# EasyEDA Pro project ProPrj_OASman SMD test board 2_2025-03-03.epro

# Schematic Schematic1_3
Board Name: SMD test 2; Create Date: 2025-02-23; Page Name: P1; Project Name: OASman SMD test board 2; Schematic Name: Schematic1_3; Update Date: 2025-02-23; Company: EasyEDA.com; Page Size: A4; Version: V1.0
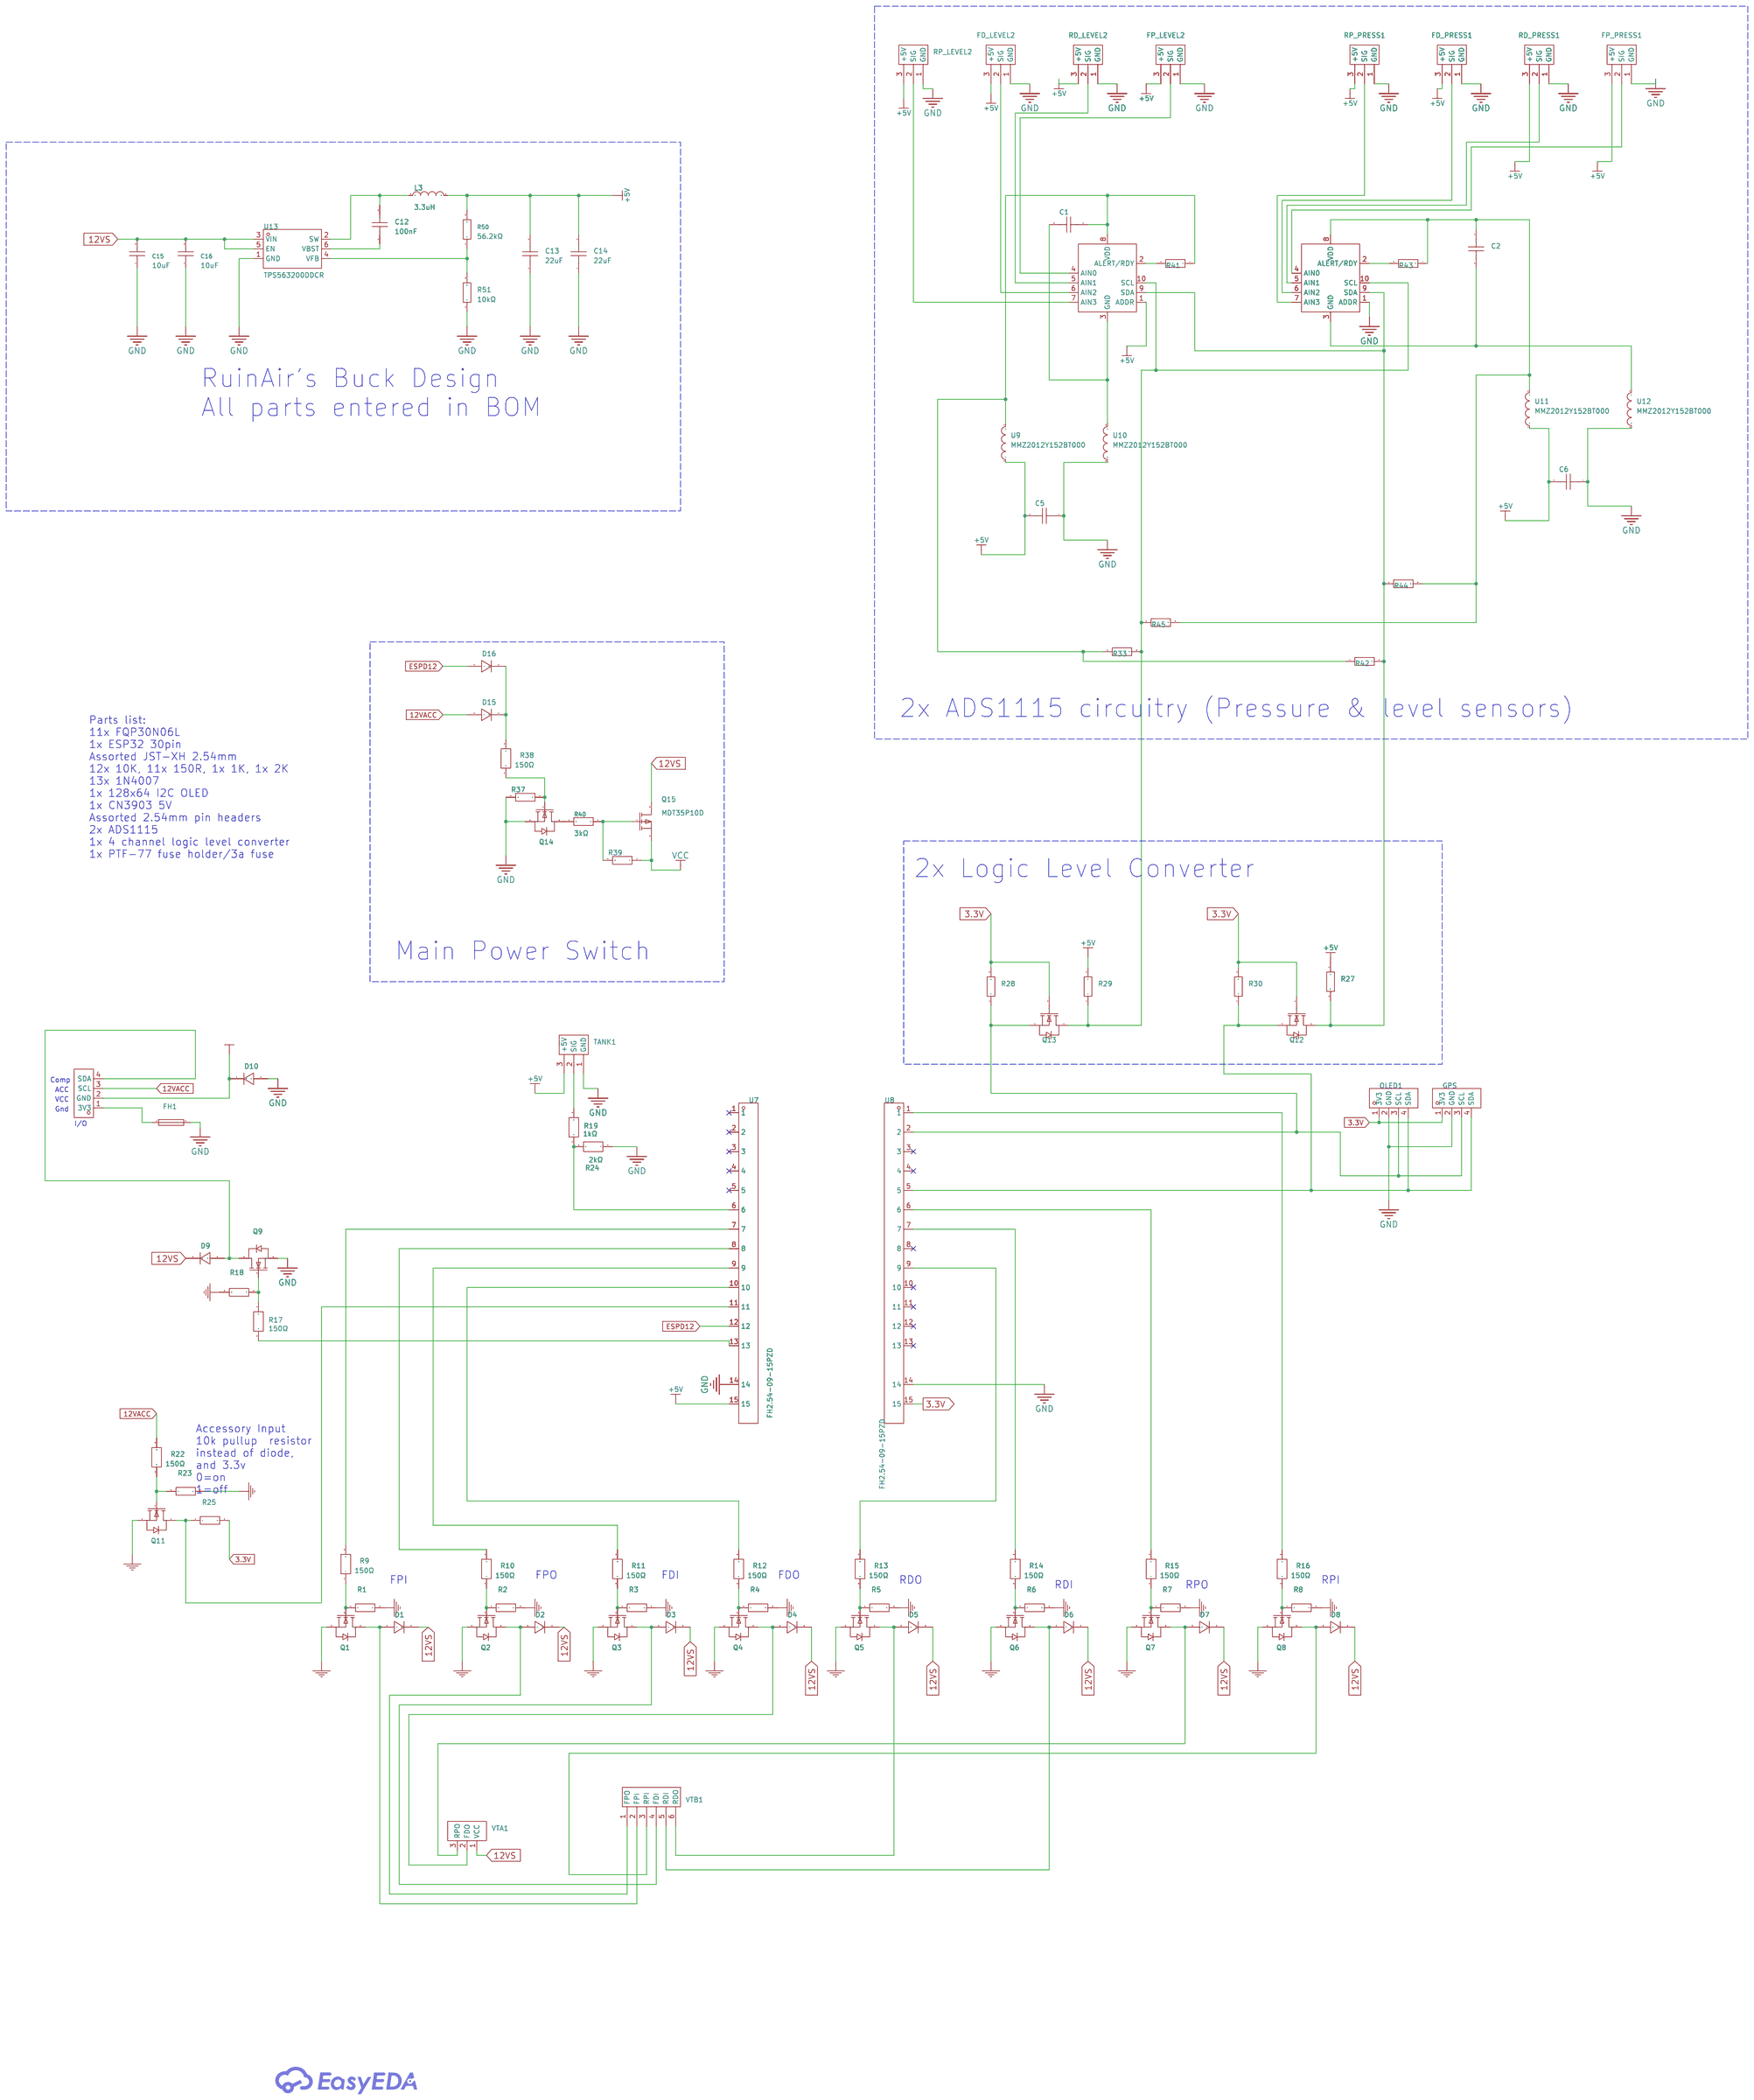
[diagram p0: schematic sheet]

## Parts
C1  1uF  [C0603]
C2  1uF  [C0603]
C5  1uF  [C0603]
C6  1uF  [C0603]
C12  100nF  [C0402]
C13  22uF  [C0805]
C14  22uF  [C0805]
C15  10uF  [C1206]
C16  10uF  [C1206]
CN1  XH-4A绿色  [CONN-TH_XH-4A-1]
D1  SM4007PL  [SOD-123F_L2.8-W1.8-LS3.7-RD]
D2  SM4007PL  [SOD-123F_L2.8-W1.8-LS3.7-RD]
D3  SM4007PL  [SOD-123F_L2.8-W1.8-LS3.7-RD]
D4  SM4007PL  [SOD-123F_L2.8-W1.8-LS3.7-RD]
D5  SM4007PL  [SOD-123F_L2.8-W1.8-LS3.7-RD]
D6  SM4007PL  [SOD-123F_L2.8-W1.8-LS3.7-RD]
D7  SM4007PL  [SOD-123F_L2.8-W1.8-LS3.7-RD]
D8  SM4007PL  [SOD-123F_L2.8-W1.8-LS3.7-RD]
D9  SM4007PL  [SOD-123F_L2.8-W1.8-LS3.7-RD]
D10  SM4007PL  [SOD-123F_L2.8-W1.8-LS3.7-RD]
D15  SM4007PL  [SOD-123F_L2.8-W1.8-LS3.7-RD]
D16  SM4007PL  [SOD-123F_L2.8-W1.8-LS3.7-RD]
FD_LEVEL2  XH-3A  [CONN-TH_XH-3A]
FD_PRESS1  XH-3A  [CONN-TH_XH-3A]
FH1  PTF-77  [FUSE-TH_L24.4-W9.4-P22.60]
FP_LEVEL2  XH-3A  [CONN-TH_XH-3A]
FP_PRESS1  XH-3A  [CONN-TH_XH-3A]
GPS  XH-4A绿色  [CONN-TH_XH-4A-1]
L3  3.3uH  [IND-SMD_L4.5-W4.1_SL0420]
OLED1  XH-4A绿色  [CONN-TH_XH-4A-1]
Q1  MDT30N06L  [TO-252-2_L6.6-W5.6-P4.60-LS9.7-BR]
Q2  MDT30N06L  [TO-252-2_L6.6-W5.6-P4.60-LS9.7-BR]
Q3  MDT30N06L  [TO-252-2_L6.6-W5.6-P4.60-LS9.7-BR]
Q4  MDT30N06L  [TO-252-2_L6.6-W5.6-P4.60-LS9.7-BR]
Q5  MDT30N06L  [TO-252-2_L6.6-W5.6-P4.60-LS9.7-BR]
Q6  MDT30N06L  [TO-252-2_L6.6-W5.6-P4.60-LS9.7-BR]
Q7  MDT30N06L  [TO-252-2_L6.6-W5.6-P4.60-LS9.7-BR]
Q8  MDT30N06L  [TO-252-2_L6.6-W5.6-P4.60-LS9.7-BR]
Q9  MDT30N06L  [TO-252-2_L6.6-W5.6-P4.60-LS9.7-BR]
Q11  MDT30N06L  [TO-252-2_L6.6-W5.6-P4.60-LS9.7-BR]
Q12  BSS138  [SOT-23-3_L2.9-W1.6-P1.90-LS2.8-BR]
Q13  BSS138  [SOT-23-3_L2.9-W1.6-P1.90-LS2.8-BR]
Q14  MDT30N06L  [TO-252-2_L6.6-W5.6-P4.60-LS9.7-BR]
Q15  MDT35P10D  [TO-252-2_L6.6-W6.1-P4.57-LS9.9-BR-CW]
R1  10kΩ  [R1206]
R2  10kΩ  [R1206]
R3  10kΩ  [R1206]
R4  10kΩ  [R1206]
R5  10kΩ  [R1206]
R6  10kΩ  [R1206]
R7  10kΩ  [R1206]
R8  10kΩ  [R1206]
R9  150Ω  [R1206]
R10  150Ω  [R1206]
R11  150Ω  [R1206]
R12  150Ω  [R1206]
R13  150Ω  [R1206]
R14  150Ω  [R1206]
R15  150Ω  [R1206]
R16  150Ω  [R1206]
R17  150Ω  [R1206]
R18  10kΩ  [R1206]
R19  1kΩ  [R1206]
R22  150Ω  [R1206]
R23  10kΩ  [R1206]
R24  2kΩ  [R1206]
R25  10kΩ  [R1206]
R27  10kΩ  [R1206]
R28  10kΩ  [R1206]
R29  10kΩ  [R1206]
R30  10kΩ  [R1206]
R33  1MΩ  [R1206]
R37  10kΩ  [R1206]
R38  150Ω  [R1206]
R39  10kΩ  [R1206]
R40  3kΩ  [R1206]
R41  1MΩ  [R1206]
R42  1MΩ  [R1206]
R43  1MΩ  [R1206]
R44  1MΩ  [R1206]
R45  1MΩ  [R1206]
R50  56.2kΩ  [R0402]
R51  10kΩ  [R0402]
RD_LEVEL2  XH-3A  [CONN-TH_XH-3A]
RD_PRESS1  XH-3A  [CONN-TH_XH-3A]
RP_LEVEL2  XH-3A  [CONN-TH_XH-3A]
RP_PRESS1  XH-3A  [CONN-TH_XH-3A]
TANK1  XH-3A  [CONN-TH_XH-3A]
U4  ADS1115IDGSR  [MSOP-10_L3.0-W3.0-P0.50-LS5.0-BL]
U5  ADS1115IDGSR  [MSOP-10_L3.0-W3.0-P0.50-LS5.0-BL]
U7  FH2.54-09-15PZD  [HDR-TH_15P-P2.54-V-F-1]
U8  FH2.54-09-15PZD  [HDR-TH_15P-P2.54-V-F-1]
U9  MMZ2012Y152BT000  [L0805]
U10  MMZ2012Y152BT000  [L0805]
U11  MMZ2012Y152BT000  [L0805]
U12  MMZ2012Y152BT000  [L0805]
U13  TPS563200DDCR  [SOT-23-6_L2.9-W1.6-P0.95-LS2.8-BR]
VTA1  XH-3A  [CONN-TH_XH-3A]
VTB1  XH-6A  [CONN-TH_6P-P2.50_XH-6A]

## Library data of the parts
C1 C2 C5 C6 = GRM188R61H105KAALD: Capacitance: Tolerance:±10% Tolerance:±10% Voltage Rated: Temperature Coefficient:; LCSC Part Name: 1uF ±10% 50V; Supplier Part: C77386; Manufacturer: muRata(村田); Supplier Footprint: 0603; JLCPCB Part Class: Extended Part; Datasheet: https://atta.szlcsc.com/upload/public/pdf/source/20170116/1484561238855.pdf; Supplier: LCSC; Tolerance: ±10%
C12 = CL05B104KB54PNC: Capacitance: Tolerance:±10% Tolerance:±10% Voltage Rated: Temperature Coefficient:; LCSC Part Name: 100nF ±10% 50V; Supplier Part: C307331; Manufacturer: SAMSUNG(三星); Supplier Footprint: 0402; JLCPCB Part Class: Basic Part; Datasheet: https://atta.szlcsc.com/upload/public/pdf/source/20160218/1457707763339.pdf; Supplier: LCSC; Tolerance: ±10%
C13 C14 = CL21A226MAQNNNE: Capacitance: Tolerance:±20% Tolerance:±20% Voltage Rated: Temperature Coefficient:; LCSC Part Name: 22uF ±20% 25V; Supplier Part: C45783; Manufacturer: SAMSUNG(三星); Supplier Footprint: 0805; JLCPCB Part Class: Basic Part; Datasheet: https://atta.szlcsc.com/upload/public/pdf/source/20160218/1457707763339.pdf; Supplier: LCSC; Tolerance: ±20%
C15 C16 = CL31A106KBHNNNE: Capacitance: Tolerance:±10% Tolerance:±10% Voltage Rated: Temperature Coefficient:; LCSC Part Name: 10uF ±10% 50V; Supplier Part: C13585; Manufacturer: SAMSUNG(三星); Supplier Footprint: 1206; JLCPCB Part Class: Basic Part; Datasheet: https://atta.szlcsc.com/upload/public/pdf/source/20160218/1457707763339.pdf; Supplier: LCSC; Tolerance: ±10%
CN1 GPS OLED1 = XH-4A绿色: Pins Structure:1x4P Pitch:- Mounting Style:- Reference Series:XH Number of Pins:4P Number of Rows:1 Number of PINs Per Row:4 Row Spacing:- Contact Material:-; LCSC Part Name: 1x4P 系列:XH; Supplier Part: C192885; Manufacturer: BOOMELE(博穆精密); Supplier Footprint: 插件,P=2.5mm; JLCPCB Part Class: Extended Part; Supplier: LCSC; Pins Structure: 1x4P; Reference Series: XH; Number of Pins: 4P; Number of Rows: 1; Number of PINs Per Row: 4
D1-D10 D15 D16 = SM4007PL_C64898: Diode Configuration: Forward Voltage (Vf@If):1.1V@1A Reverse Voltage (Vr): Rectified Current: Reverse Leakage Current:10uA@1kV; LCSC Part Name: 电压:1kV 电流:1A; Supplier Part: C64898; Manufacturer: MDD(辰达半导体); Supplier Footprint: SOD-123FL; JLCPCB Part Class: Basic Part; Datasheet: https://atta.szlcsc.com/upload/public/pdf/source/20230823/16A8FDE162764C9B685A3717F2DA3690.pdf; Supplier: LCSC; Forward Voltage (Vf@If): 1.1V@1A; Reverse Leakage Current: 10uA@1kV
FD_LEVEL2 FD_PRESS1 FP_LEVEL2 FP_PRESS1 RD_LEVEL2 RD_PRESS1 RP_LEVEL2 RP_PRESS1 TANK1 VTA1 = XH-3A_C2316: Pins Structure:1x3P Pitch:2.5mm Mounting Style:- Reference Series:XH Number of Pins:3P Number of Rows:1 Number of PINs Per Row:3 Row Spacing:- Contact Material:-; LCSC Part Name: 1x3P 间距:2.5mm 系列:XH; Supplier Part: C2316; Manufacturer: BOOMELE(博穆精密); Supplier Footprint: 插件,P=2.5mm; JLCPCB Part Class: Extended Part; Datasheet: https://atta.szlcsc.com/upload/public/pdf/source/20151222/1457707654251.pdf; Supplier: LCSC; Pins Structure: 1x3P; Pitch: 2.5mm; Reference Series: XH; Number of Pins: 3P; Number of Rows: 1; Number of PINs Per Row: 3
FH1 = PTF-77: Fuseholder Type:- Voltage Rating:250V Current Rating:10A Fuse Type:- Fuse Size:-; LCSC Part Name: 保险丝座 5x20mm 绿色 2件套; Supplier Part: C717030; Manufacturer: XFCN(兴飞); JLCPCB Part Class: Extended Part; Datasheet: https://atta.szlcsc.com/upload/public/pdf/source/20241204/2C5BCE3FA349D3ADCF55CB0838B92C4A.pdf; Supplier: LCSC; Voltage Rating: 250V; Current Rating: 10A
L3 = SL0420-3R3M: Inductance: Tolerance:±20% Tolerance:±20% Rated Current: Saturation Current (Isat):4A; LCSC Part Name: 3.3uH ±20% 4A; Supplier Part: C22463807; Manufacturer: 台湾陆海; Supplier Footprint: SMD,4.5x4.1mm; JLCPCB Part Class: Extended Part; Datasheet: https://atta.szlcsc.com/upload/public/pdf/source/20240611/8DE7D6BE1273F2E871C82A6D5C20B08D.pdf; Supplier: LCSC; Tolerance: ±20%; Saturation Current (Isat): 4A
Q1-Q9 Q11 Q14 = MDT30N06L: Type:1 N-channel Drain Source Voltage (Vdss):60V Continuous Drain Current (Id): Drain Source On Resistance (RDS(on)@Vgs,Id):40mΩ@4.5V Power Dissipation (Pd): Gate Threshold Voltage (Vgs(th)@Id):1.8V@250uA Total Gate Charge (Qg@Vgs):21nC@10V Input Capacita; LCSC Part Name: 1个N沟道 耐压:60V 电流:30A; Supplier Part: C5240683; Manufacturer: minos(迈诺斯); Supplier Footprint: TO-252-2L; JLCPCB Part Class: Extended Part; Datasheet: https://atta.szlcsc.com/upload/public/pdf/source/20240829/EA64E09E95BF58FCAC7BF20D9AEBC519.pdf; Supplier: LCSC; Type: 1 N-channel; Drain Source Voltage (Vdss): 60V; Drain Source On Resistance (RDS(on)@Vgs,Id): 40mΩ@4.5V; Gate Threshold Voltage (Vgs(th)@Id): 1.8V@250uA; Total Gate Charge (Qg@Vgs): 21nC@10V; Input Capacitance (Ciss@Vds): 670pF; Reverse Transfer Capacitance (Crss@Vds): 66pF; Operating Temperature: -55℃~+175℃
Q12 Q13 = BSS138_C112239: Type:1 N-Channel Drain Source Voltage (Vdss): Continuous Drain Current (Id): Power Dissipation (Pd): Drain Source On Resistance (RDS(on)@Vgs,Id):3.5Ω@10V,220mA Gate Threshold Voltage (Vgs(th)@Id):1.5V@1mA; LCSC Part Name: 1个N沟道 耐压:50V 电流:220mA; Supplier Part: C112239; Manufacturer: SHIKUES(时科); Supplier Footprint: SOT-23; JLCPCB Part Class: Extended Part; Datasheet: https://atta.szlcsc.com/upload/public/pdf/source/20170720/1500524147280.pdf; Supplier: LCSC; Type: 1 N-Channel; Drain Source On Resistance (RDS(on)@Vgs,Id): 3.5Ω@10V,220mA; Gate Threshold Voltage (Vgs(th)@Id): 1.5V@1mA
Q15 = MDT35P10D: Type:1 Piece P-Channel Drain Source Voltage (Vdss): Continuous Drain Current (Id): Drain Source On Resistance (RDS(on)@Vgs,Id):26mΩ@10V,15A Power Dissipation (Pd): Gate Threshold Voltage (Vgs(th)@Id):2V@250uA Total Gate Charge (Qg@Vgs):40nC@10V Input Capa; LCSC Part Name: 1个P沟道 耐压:100V 电流:35A; Supplier Part: C5890267; Manufacturer: minos(迈诺斯); Supplier Footprint: TO252; JLCPCB Part Class: Extended Part; Datasheet: https://atta.szlcsc.com/upload/public/pdf/source/20230704/A90682651C9529CA52851179CB8911E0.pdf; Supplier: LCSC; Type: 1 Piece P-Channel; Drain Source On Resistance (RDS(on)@Vgs,Id): 26mΩ@10V,15A; Gate Threshold Voltage (Vgs(th)@Id): 2V@250uA; Total Gate Charge (Qg@Vgs): 40nC@10V; Input Capacitance (Ciss@Vds): 2.315nF@25V; Reverse Transfer Capacitance (Crss@Vds): 11pF@25V
R1-R8 R18 R23 R25 R27-R30 R37 R39 = 1206W4F1002T5E: Type:Thick Film Resistors Resistance:10kΩ Tolerance:±1% Tolerance:±1% Power(Watts): Overload Voltage (Max): Temperature Coefficient:±100ppm/℃ Temperature Coefficient:±100ppm/℃ Operating Temperature Range:-55℃~+155℃ Operating Temperature Range:-55℃~+155℃; LCSC Part Name: 10kΩ ±1% 250mW 厚膜电阻; Supplier Part: C17902; Manufacturer: UNI-ROYAL(厚声); Supplier Footprint: 1206; JLCPCB Part Class: Basic Part; Datasheet: https://atta.szlcsc.com/upload/public/pdf/source/20200306/C422600_1E6D84923E4A46A82E41ADD87F860B5C.pdf; Supplier: LCSC; Type: Thick Film Resistors; Tolerance: ±1%; Temperature Coefficient: ±100ppm/℃; Operating Temperature Range: -55℃~+155℃
R9-R17 R22 R38 = FRC1206J151 TS: Type:Thick Film Resistors Resistance: Tolerance:±5% Tolerance:±5% Power(Watts): Overload Voltage (Max): Temperature Coefficient:±100ppm/℃ Temperature Coefficient:±100ppm/℃ Operating Temperature Range:-55℃~+155℃ Operating Temperature Range:-55℃~+155℃; LCSC Part Name: 150Ω ±5% 250mW 厚膜电阻; Supplier Part: C2907432; Manufacturer: FOJAN(富捷); Supplier Footprint: 1206; JLCPCB Part Class: Extended Part; Datasheet: https://atta.szlcsc.com/upload/public/pdf/source/20211221/925EC7D7225764EE0046F22065062C87.pdf; Supplier: LCSC; Type: Thick Film Resistors; Tolerance: ±5%; Temperature Coefficient: ±100ppm/℃; Operating Temperature Range: -55℃~+155℃
R19 = FRC1206J102 TS: Type:Thick Film Resistors Resistance:1kΩ Tolerance:±5% Tolerance:±5% Power(Watts): Overload Voltage (Max): Temperature Coefficient:±100ppm/℃ Temperature Coefficient:±100ppm/℃ Operating Temperature Range:-55℃~+155℃ Operating Temperature Range:-55℃~+155℃; LCSC Part Name: 1kΩ ±5% 250mW 厚膜电阻; Supplier Part: C2907440; Manufacturer: FOJAN(富捷); Supplier Footprint: 1206; JLCPCB Part Class: Extended Part; Datasheet: https://atta.szlcsc.com/upload/public/pdf/source/20211221/925EC7D7225764EE0046F22065062C87.pdf; Supplier: LCSC; Type: Thick Film Resistors; Tolerance: ±5%; Temperature Coefficient: ±100ppm/℃; Operating Temperature Range: -55℃~+155℃
R24 = FRC1206J202 TS: Type:Thick Film Resistors Resistance:2kΩ Tolerance:±5% Tolerance:±5% Power(Watts): Overload Voltage (Max): Temperature Coefficient:±100ppm/℃ Temperature Coefficient:±100ppm/℃ Operating Temperature Range:-55℃~+155℃ Operating Temperature Range:-55℃~+155℃; LCSC Part Name: 2kΩ ±5% 250mW 厚膜电阻; Supplier Part: C2907466; Manufacturer: FOJAN(富捷); Supplier Footprint: 1206; JLCPCB Part Class: Extended Part; Datasheet: https://atta.szlcsc.com/upload/public/pdf/source/20211221/925EC7D7225764EE0046F22065062C87.pdf; Supplier: LCSC; Type: Thick Film Resistors; Tolerance: ±5%; Temperature Coefficient: ±100ppm/℃; Operating Temperature Range: -55℃~+155℃
R33 R41-R45 = 1206W4F1004T5E: Type:Thick Film Resistors Resistance:1MΩ Tolerance:±1% Tolerance:±1% Power(Watts): Overload Voltage (Max): Temperature Coefficient:±100ppm/℃ Temperature Coefficient:±100ppm/℃ Operating Temperature Range:-55℃~+155℃ Operating Temperature Range:-55℃~+155℃; LCSC Part Name: 1MΩ ±1% 250mW 厚膜电阻; Supplier Part: C17927; Manufacturer: UNI-ROYAL(厚声); Supplier Footprint: 1206; JLCPCB Part Class: Basic Part; Datasheet: https://atta.szlcsc.com/upload/public/pdf/source/20200306/C422600_1E6D84923E4A46A82E41ADD87F860B5C.pdf; Supplier: LCSC; Type: Thick Film Resistors; Tolerance: ±1%; Temperature Coefficient: ±100ppm/℃; Operating Temperature Range: -55℃~+155℃
R40 = 1206W4F3001T5E: Type:Thick Film Resistors Resistance:3kΩ Tolerance:±1% Tolerance:±1% Power(Watts): Overload Voltage (Max): Temperature Coefficient:±100ppm/℃ Temperature Coefficient:±100ppm/℃ Operating Temperature Range:-55℃~+155℃ Operating Temperature Range:-55℃~+155℃; LCSC Part Name: 3kΩ ±1% 250mW 厚膜电阻; Supplier Part: C18012; Manufacturer: UNI-ROYAL(厚声); Supplier Footprint: 1206; JLCPCB Part Class: Extended Part; Datasheet: https://atta.szlcsc.com/upload/public/pdf/source/20200306/C422600_1E6D84923E4A46A82E41ADD87F860B5C.pdf; Supplier: LCSC; Type: Thick Film Resistors; Tolerance: ±1%; Temperature Coefficient: ±100ppm/℃; Operating Temperature Range: -55℃~+155℃
R50 = 0402WGF5622TCE: Type:Thick Film Resistors Resistance:56.2kΩ Tolerance:±1% Tolerance:±1% Power(Watts): Overload Voltage (Max): Temperature Coefficient:±100ppm/℃ Temperature Coefficient:±100ppm/℃ Operating Temperature Range:-55℃~+155℃ Operating Temperature Range:-55℃~+155℃; LCSC Part Name: 56.2kΩ ±1% 62.5mW 厚膜电阻; Supplier Part: C54968; Manufacturer: UNI-ROYAL(厚声); Supplier Footprint: 0402; JLCPCB Part Class: Extended Part; Datasheet: https://atta.szlcsc.com/upload/public/pdf/source/20200306/C422600_1E6D84923E4A46A82E41ADD87F860B5C.pdf; Supplier: LCSC; Type: Thick Film Resistors; Tolerance: ±1%; Temperature Coefficient: ±100ppm/℃; Operating Temperature Range: -55℃~+155℃
R51 = 0402WGF1002TCE: Type:Thick Film Resistors Resistance:10kΩ Tolerance:±1% Tolerance:±1% Power(Watts): Overload Voltage (Max): Temperature Coefficient:±100ppm/℃ Temperature Coefficient:±100ppm/℃ Operating Temperature Range:-55℃~+155℃ Operating Temperature Range:-55℃~+155℃; LCSC Part Name: 10kΩ ±1% 62.5mW 厚膜电阻; Supplier Part: C25744; Manufacturer: UNI-ROYAL(厚声); Supplier Footprint: 0402; JLCPCB Part Class: Basic Part; Datasheet: https://atta.szlcsc.com/upload/public/pdf/source/20200306/C422600_1E6D84923E4A46A82E41ADD87F860B5C.pdf; Supplier: LCSC; Type: Thick Film Resistors; Tolerance: ±1%; Temperature Coefficient: ±100ppm/℃; Operating Temperature Range: -55℃~+155℃
U4 U5 = ADS1115IDGSR: Interface:I2C differential input:Yes number of channels:2 Supply Voltage:2V~5.5V Supply Voltage:2V~5.5V sampling frequency:860Hz resolution:16Bit Operating Temperature:-40℃~+125℃ Operating Temperature:-40℃~+125℃; LCSC Part Name: 具有内部基准、振荡器和可编程比较器且兼容 I2C 的ADS111x、超小型、低功耗 860SPS、16位ADC; Supplier Part: C37593; Manufacturer: TI(德州仪器); Supplier Footprint: VSSOP-10; JLCPCB Part Class: Extended Part; Datasheet: https://www.ti.com/cn/lit/gpn/ads1115; Supplier: LCSC; Interface: I2C; differential input: Yes; number of channels: 2; Supply Voltage: 2V~5.5V; sampling frequency: 860Hz; resolution: 16Bit; Operating Temperature: -40℃~+125℃
U7 U8 = FH2.54-09-15PZD: Supplier Part: C7500782; Manufacturer: XUNPU(讯普); Supplier Footprint: 插件,P=2.54mm; JLCPCB Part Class: Extended Part; Datasheet: https://atta.szlcsc.com/upload/public/pdf/source/20230809/12C46BEDB70740F4680EB1129D481D12.pdf; Supplier: LCSC
U9-U12 = MMZ2012Y152BT000: Impedance @ Frequency:1.5kΩ@100MHz Tolerance:±25% Tolerance:±25% DC Resistance:400mΩ Current Rating:500mA Circuits:1; LCSC Part Name: 单路 0805磁珠 阻抗1.5kΩ@100MHz; Supplier Part: C275472; Manufacturer: TDK; Supplier Footprint: 0805; JLCPCB Part Class: Extended Part; Datasheet: https://atta.szlcsc.com/upload/public/pdf/source/20181106/C275473_2EC114D49694D3C27D9CDAEC3D6C9E6C.pdf; Supplier: LCSC; Impedance @ Frequency: 1.5kΩ@100MHz; Tolerance: ±25%; DC Resistance: 400mΩ; Current Rating: 500mA; Circuits: 1
U13 = TPS563200DDCR: Function:Step-down type Output Type:Adjustable Input Voltage:4.5V~17V Input Voltage:4.5V~17V Output Voltage:760mV~7V Output Voltage:760mV~7V Output Current:3A Switching Frequency:650kHz Switching Frequency:650kHz Operating Temperature:-40℃~+125℃ Operating; LCSC Part Name: 4.5V至17V输入,2A/3A同步降压稳压器; Supplier Part: C97253; Manufacturer: TI(德州仪器); Supplier Footprint: TSOT-23-6; JLCPCB Part Class: Extended Part; Datasheet: https://www.ti.com/cn/lit/gpn/tps563200; Supplier: LCSC; Function: Step-down type; Output Type: Adjustable; Input Voltage: 4.5V~17V; Output Voltage: 760mV~7V; Output Current: 3A; Switching Frequency: 650kHz; Operating Temperature: -40℃~+125℃; Synchronous Rectification: Yes; Number of Outputs: 1; Topology: Step-down; Quiescent Current (Iq): 290uA; Switch tube (built-in/external): Built-in
VTB1 = XH-6A_C5663: Pins Structure:1x6P Pitch:2.5mm Mounting Style:- Reference Series:XH Number of Pins:6P Number of Rows:1 Number of PINs Per Row:6 Row Spacing:- Contact Material:-; LCSC Part Name: 系列:XH 间距:2.5mm 1x6P; Supplier Part: C5663; Manufacturer: BOOMELE(博穆精密); Supplier Footprint: 插件,P=2.5mm; JLCPCB Part Class: Extended Part; Datasheet: https://atta.szlcsc.com/upload/public/pdf/source/20151222/1457707654251.pdf; Supplier: LCSC; Pins Structure: 1x6P; Pitch: 2.5mm; Reference Series: XH; Number of Pins: 6P; Number of Rows: 1; Number of PINs Per Row: 6

## Nets
3.3V: GPS.1(3V3) OLED1.1(3V3) Q12.1(G) Q13.1(G) R25.2 R28.2 R30.2 U8.15
12VACC: CN1.3(SCL) D15.2(A) R22.2
12VS: C15.2 C16.2 D1.1(C) D2.1(C) D3.1(C) D4.1(C) D5.1(C) D6.1(C) D7.1(C) D8.1(C) D9.1(C) Q15.2(D) U13.3(VIN) U13.5(EN) VTA1.1(VCC)
+5V: C5.2 C6.2 C13.2 C14.2 FD_LEVEL2.3(+5V) FD_PRESS1.3(+5V) FP_LEVEL2.3(+5V) FP_PRESS1.3(+5V) L3.2 R27.1 R29.2 R50.2 RD_LEVEL2.3(+5V) RD_PRESS1.3(+5V) RP_LEVEL2.3(+5V) RP_PRESS1.3(+5V) TANK1.3(+5V) U4.1(ADDR) U7.15 U9.1 U11.1
GND: C5.1 C6.1 C13.1 C14.1 C15.1 C16.1 D10.2(A) FD_LEVEL2.1(GND) FD_PRESS1.1(GND) FH1.2 FP_LEVEL2.1(GND) FP_PRESS1.1(GND) GPS.2(GND) OLED1.2(GND) Q1.3(S) Q2.3(S) Q3.3(S) Q4.3(S) Q5.3(S) Q6.3(S) Q7.3(S) Q8.3(S) Q9.3(S) Q11.3(S) Q14.3(S) R1.2 R2.2 R3.2 R4.2 R5.2 R6.2 R7.2 R8.2 R18.2 R23.2 R24.1 R37.2 R51.1 RD_LEVEL2.1(GND) RD_PRESS1.1(GND) RP_LEVEL2.1(GND) RP_PRESS1.1(GND) TANK1.1(GND) U5.1(ADDR) U7.14 U8.14 U10.1 U12.1 U13.1(GND)
VCC: CN1.2(GND) D10.1(C) Q15.3(S) R39.1
ESPD12: D16.2(A) U7.12
$1N4350: Q8.1(G) R8.1 R16.1
$1N4351: Q7.1(G) R7.1 R15.1
$1N4352: Q6.1(G) R6.1 R14.1
$1N4353: Q5.1(G) R5.1 R13.1
$1N4354: Q4.1(G) R4.1 R12.1
$1N4355: Q3.1(G) R3.1 R11.1
$1N4356: Q2.1(G) R2.1 R10.1
$1N4357: Q1.1(G) R1.1 R9.1
$1N4371: D4.2(A) Q4.2(D) VTA1.2(FDO)
$1N4376: Q9.1(G) R17.1 R18.1
$1N4377: R10.2 U7.8
$1N4378: R11.2 U7.9
$1N4379: CN1.4(SDA) D9.2(A) Q9.2(D)
$1N4380: R13.2 U8.9
$1N4381: R14.2 U8.7
$1N4382: R19.2 TANK1.2(SIG)
$1N4383: R19.1 R24.2 U7.6
$1N4386: CN1.1(3V3) FH1.1
$1N4402: C2.1 R43.1 R44.2 R45.2 U5.8(VDD) U11.2
$1N4403: FD_LEVEL2.2(SIG) U4.6(AIN2)
$1N4407: FP_LEVEL2.2(SIG) U4.4(AIN0)
$1N4413: RD_LEVEL2.2(SIG) U4.5(AIN1)
$1N4416: RD_PRESS1.2(SIG) U5.5(AIN1)
$1N4419: C1.1 R33.1 R41.1 R42.1 U4.8(VDD) U9.2
$1N4423: RP_LEVEL2.2(SIG) U4.7(AIN3)
$1N4424: FD_PRESS1.2(SIG) U5.6(AIN2)
$1N4428: RP_PRESS1.2(SIG) U5.7(AIN3)
$1N4434: Q11.2(D) R25.1 U7.11
$1N4435: R17.2 U7.13
$1N4436: R16.2 U8.1
$1N4438: R9.2 U7.7
$1N4442: R15.2 U8.6
$1N4443: FP_PRESS1.2(SIG) U5.4(AIN0)
$1N4453: Q12.3(D) R27.2 R42.2 R44.1 U4.9(SDA) U5.9(SDA)
$1N4455: Q11.1(G) R22.1 R23.1
$1N4460: R12.2 U7.10
$1N4475: Q14.2(D) R40.1
$1N4476: Q15.1(G) R39.2 R40.2
$1N4478: Q14.1(G) R37.1 R38.1
$1N4481: D7.2(A) Q7.2(D) VTA1.3(RPO)
$1N12707: C1.2 U4.3(GND) U10.2
$1N12784: R41.2 U4.2(ALERT/RDY)
$1N13030: C2.2 U5.3(GND) U12.2
$1N13089: R43.2 U5.2(ALERT/RDY)
$1N19364: GPS.4(SDA) OLED1.4(SDA) Q12.2(S) R30.1 U8.5
$1N19403: Q13.3(D) R29.1 R33.2 R45.1 U4.10(SCL) U5.10(SCL)
$1N19476: GPS.3(SCL) OLED1.3(SCL) Q13.2(S) R28.1 U8.2
$1N23795: D15.1(C) D16.1(C) R38.2
$1N33541: C12.1 U13.6(VBST)
$1N33542: C12.2 L3.1 U13.2(SW)
$1N33547: R50.1 R51.2 U13.4(VFB)
Net-(D1-2): D1.2(A) Q1.2(D) VTB1.2(FPI)
Net-(D2-2): D2.2(A) Q2.2(D) VTB1.1(FPO)
Net-(D3-2): D3.2(A) Q3.2(D) VTB1.4(FDI)
Net-(D5-2): D5.2(A) Q5.2(D) VTB1.6(RDO)
Net-(D6-2): D6.2(A) Q6.2(D) VTB1.5(RDI)
Net-(D8-2): D8.2(A) Q8.2(D) VTB1.3(RPI)

Not connected (* = marked no-connect by the designer): U7 1* 2* 3* 4* 5*; U8 3* 4* 8* 10* 11* 12* 13*

## Notes on the sheet
- RuinAir's Buck Design
  All parts entered in BOM
- Parts list:
  11x FQP30N06L
  1x ESP32 30pin
  Assorted JST-XH 2.54mm
  12x 10K, 11x 150R, 1x 1K, 1x 2K
  13x 1N4007
  1x 128x64 I2C OLED
  1x CN3903 5V
  Assorted 2.54mm pin headers
  2x ADS1115
  1x 4 channel logic level converter
  1x PTF-77 fuse holder/3a fuse
- 2x ADS1115 circuitry (Pressure & level sensors)
- 2x Logic Level Converter
- Main Power Switch
- Comp
- ACC
- VCC
- Gnd
- I/O
- Accessory Input
  10k pullup  resistor
  instead of diode,
  and 3.3v
  0=on
  1=off
- FPO
- FDI
- FDO
- FPI
- RDO
- RDI
- RPO
- RPI

# Board PCB1_3
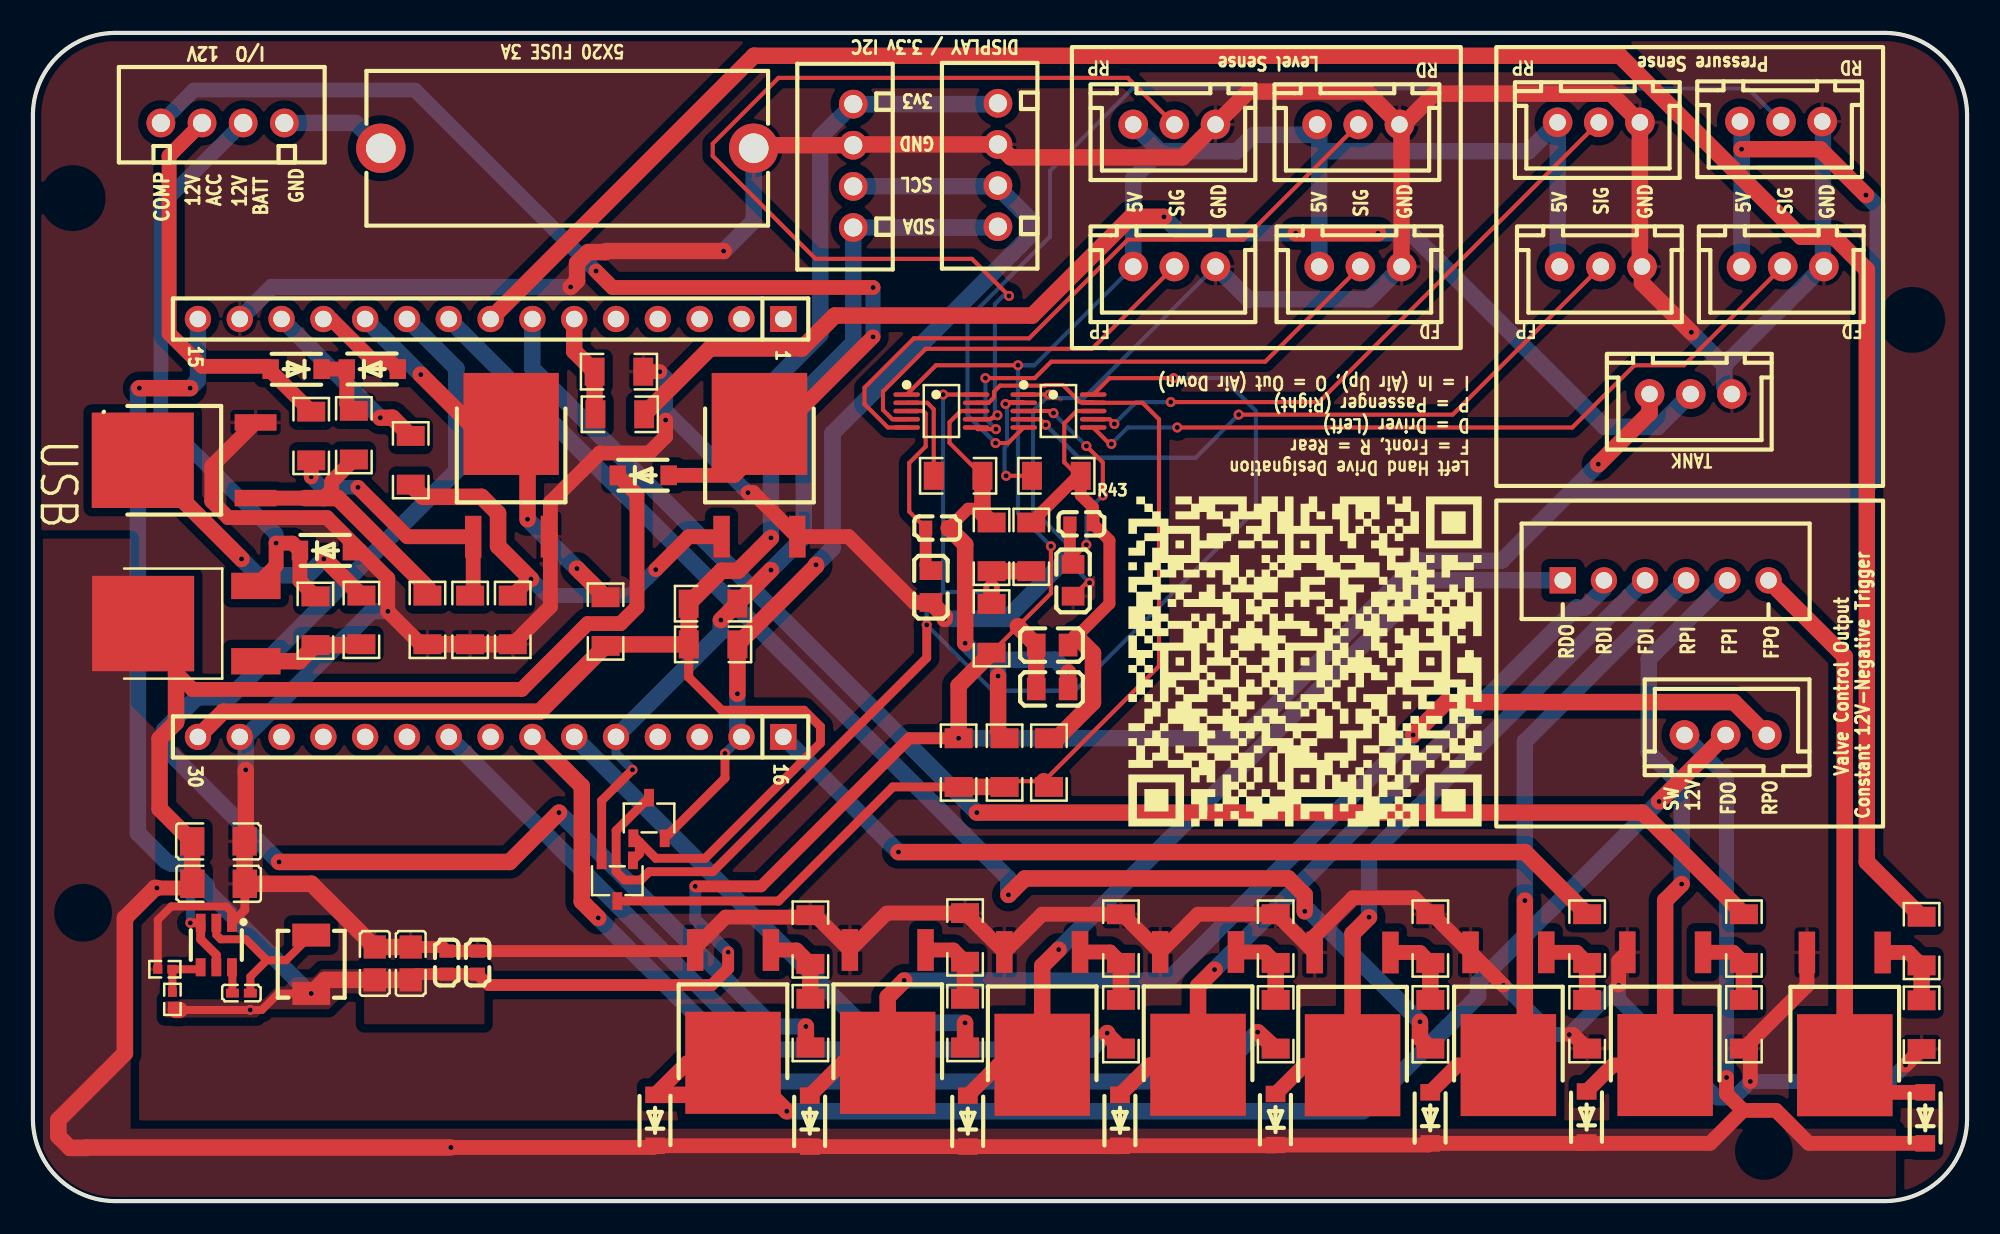
[diagram p1: board, top side]
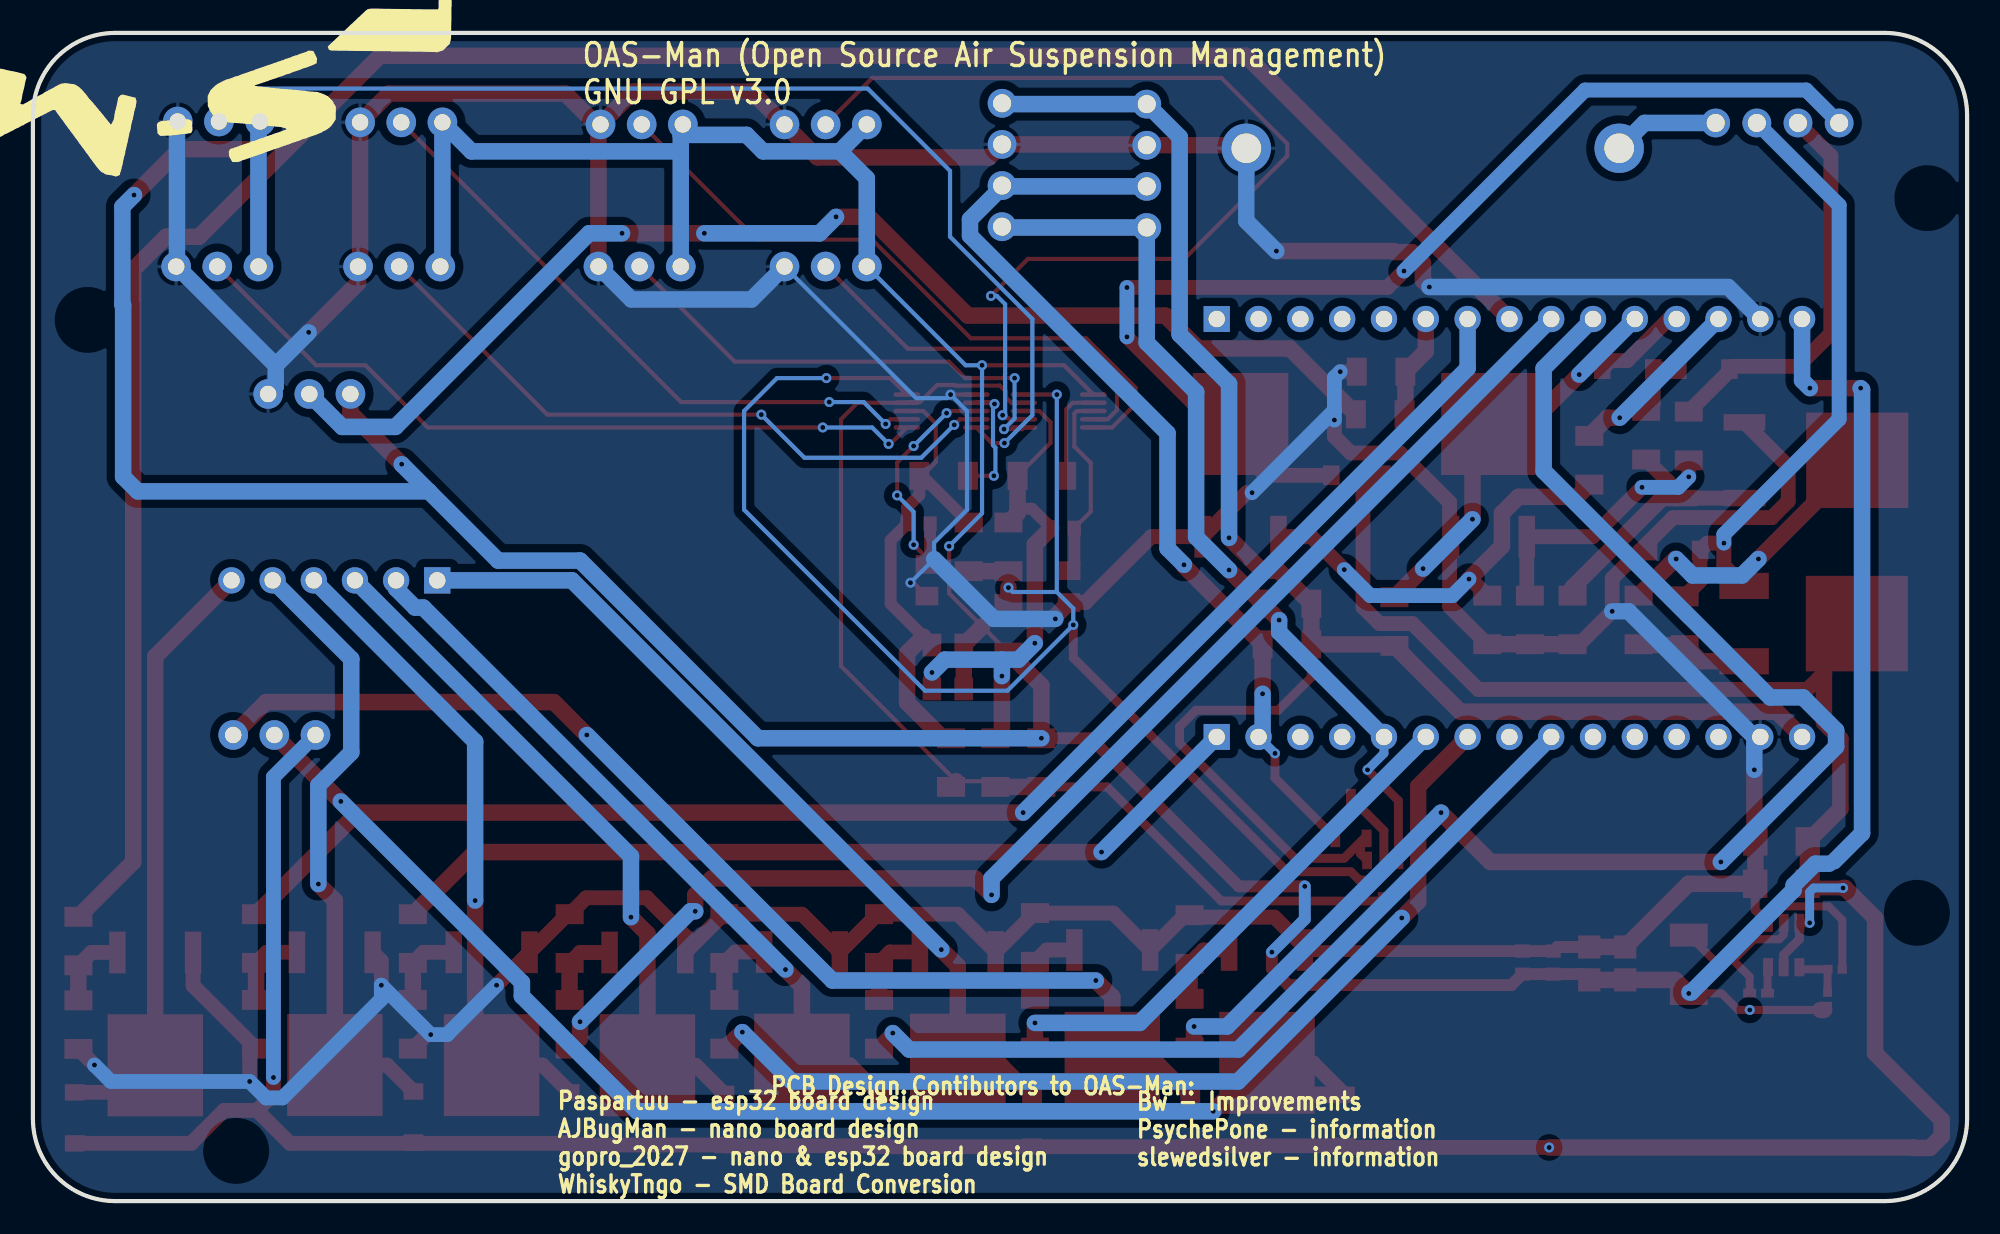
[diagram p2: board, bottom side, seen from below]

Outline 117.5 x 71 mm; copper layers: Top Layer, Bottom Layer. Coordinates in mm from the lower left corner of the outline.
Outline path: 0,66 0,5 arc(1.46,1.46) 5,0 112.5,0 arc(116.04,1.46) 117.5,5 117.5,66 arc(116.04,69.54) 112.5,71 5,71 arc(1.46,69.54) 0,66
Stack: Top Layer 0.035mm / Dielectric1 1.51mm FR4 er 4.5 / Bottom Layer 0.035mm

## Design rules (mm)
template: Custom Config
spacing copperThickness1oz: track to track 0.102, other pairs 0.152 to 0.3
spacing copperThickness2oz (default): track to track 0.203, other pairs 0.152 to 0.3
track width copperThickness1oz (default): min 0.127, default 1, max 2.54
track width copperThickness2oz: min 0.203, default 0.254, max 2.54
differential pair differentialPair (default): width min 0.127, default 0.254, max 2.54; gap min 0.152, default 0.152
via viaSize (default): diameter min 0.5, default 0.61, max 10; hole min 0.3, default 0.305, max 6.3
net $1N33547 uses Fullfill
pour e143 uses Fullfill
pour e213 uses Fullfill
pour e746 uses Fullfill
pour e1012 uses Fullfill
pour e1260 uses Fullfill

## Placement (name value [footprint] x y rotation side)
C1  1uF  [C0603]  54.93 40.91 180 top
C2  1uF  [C0603]  63.7 41.16 180 top
C5  1uF  [C0603]  25.14 14.5 270 top
C6  1uF  [C0603]  27.02 14.5 270 top
C12  100nF  [C0402]  12.67 12.64 0 top
C13  22uF  [C0805]  22.95 14.44 270 top
C14  22uF  [C0805]  20.77 14.44 270 top
C15  10uF  [C1206]  11.27 21.86 180 top
C16  10uF  [C1206]  11.28 19.28 180 top
CN1  XH-4A绿色  [CONN-TH_XH-4A-1]  11.52 65.53 180 top
D1  SM4007PL  [SOD-123F_L2.8-W1.8-LS3.7-RD]  94.39 5.11 90 top
D2  SM4007PL  [SOD-123F_L2.8-W1.8-LS3.7-RD]  114.96 5.06 90 top
D3  SM4007PL  [SOD-123F_L2.8-W1.8-LS3.7-RD]  75.49 4.96 90 top
D4  SM4007PL  [SOD-123F_L2.8-W1.8-LS3.7-RD]  37.8 4.91 90 top
D5  SM4007PL  [SOD-123F_L2.8-W1.8-LS3.7-RD]  56.79 4.86 90 top
D6  SM4007PL  [SOD-123F_L2.8-W1.8-LS3.7-RD]  66.04 4.91 90 top
D7  SM4007PL  [SOD-123F_L2.8-W1.8-LS3.7-RD]  47.19 4.86 90 top
D8  SM4007PL  [SOD-123F_L2.8-W1.8-LS3.7-RD]  84.89 5.06 90 top
D9  SM4007PL  [SOD-123F_L2.8-W1.8-LS3.7-RD]  37.07 44.11 0 top
D10  SM4007PL  [SOD-123F_L2.8-W1.8-LS3.7-RD]  17.77 39.54 0 top
D15  SM4007PL  [SOD-123F_L2.8-W1.8-LS3.7-RD]  15.99 50.56 180 top
D16  SM4007PL  [SOD-123F_L2.8-W1.8-LS3.7-RD]  20.61 50.56 0 top
FD_LEVEL2  XH-3A  [CONN-TH_XH-3A]  80.65 56.8 180 top
FD_PRESS1  XH-3A  [CONN-TH_XH-3A]  106.3 56.8 180 top
FH1  PTF-77  [FUSE-TH_L24.4-W9.4-P22.60]  32.46 63.99 0 top
FP_LEVEL2  XH-3A  [CONN-TH_XH-3A]  69.34 56.8 180 top
FP_PRESS1  XH-3A  [CONN-TH_XH-3A]  95.25 56.8 180 top
GPS  XH-4A绿色  [CONN-TH_XH-4A-1]  58.62 62.97 270 top
L3  3.3uH  [IND-SMD_L4.5-W4.1_SL0420]  16.91 14.39 270 top
OLED1  XH-4A绿色  [CONN-TH_XH-4A-1]  49.84 62.92 270 top
Q1  MDT30N06L  [TO-252-2_L6.6-W5.6-P4.60-LS9.7-BR]  99.16 11.7 90 top
Q2  MDT30N06L  [TO-252-2_L6.6-W5.6-P4.60-LS9.7-BR]  110.07 11.68 90 top
Q3  MDT30N06L  [TO-252-2_L6.6-W5.6-P4.60-LS9.7-BR]  80.17 11.68 90 top
Q4  MDT30N06L  [TO-252-2_L6.6-W5.6-P4.60-LS9.7-BR]  42.53 11.83 90 top
Q5  MDT30N06L  [TO-252-2_L6.6-W5.6-P4.60-LS9.7-BR]  61.31 11.71 90 top
Q6  MDT30N06L  [TO-252-2_L6.6-W5.6-P4.60-LS9.7-BR]  70.78 11.71 90 top
Q7  MDT30N06L  [TO-252-2_L6.6-W5.6-P4.60-LS9.7-BR]  51.93 11.83 90 top
Q8  MDT30N06L  [TO-252-2_L6.6-W5.6-P4.60-LS9.7-BR]  89.63 11.69 90 top
Q9  MDT30N06L  [TO-252-2_L6.6-W5.6-P4.60-LS9.7-BR]  44.14 43.81 270 top
Q11  MDT30N06L  [TO-252-2_L6.6-W5.6-P4.60-LS9.7-BR]  29.05 43.81 270 top
Q12  BSS138  [SOT-23-3_L2.9-W1.6-P1.90-LS2.8-BR]  35.5 19.47 90 top
Q13  BSS138  [SOT-23-3_L2.9-W1.6-P1.90-LS2.8-BR]  37.43 23.28 270 top
Q14  MDT30N06L  [TO-252-2_L6.6-W5.6-P4.60-LS9.7-BR]  10.1 45.03 0 top
Q15  MDT35P10D  [TO-252-2_L6.6-W6.1-P4.57-LS9.9-BR-CW]  10.12 35.1 0 top
R1  10kΩ  [R1206]  103.94 10.75 270 top
R2  10kΩ  [R1206]  114.74 10.72 270 top
R3  10kΩ  [R1206]  84.89 15.96 90 top
R4  10kΩ  [R1206]  47.23 15.9 90 top
R5  10kΩ  [R1206]  66.1 15.96 90 top
R6  10kΩ  [R1206]  75.5 15.96 90 top
R7  10kΩ  [R1206]  56.63 16.02 90 top
R8  10kΩ  [R1206]  94.42 10.75 270 top
R9  150Ω  [R1206]  103.94 15.96 90 top
R10  150Ω  [R1206]  114.74 15.8 90 top
R11  150Ω  [R1206]  84.89 10.75 270 top
R12  150Ω  [R1206]  47.23 10.82 270 top
R13  150Ω  [R1206]  66.1 10.75 270 top
R14  150Ω  [R1206]  75.5 10.75 270 top
R15  150Ω  [R1206]  56.63 10.82 270 top
R16  150Ω  [R1206]  94.42 15.96 90 top
R17  150Ω  [R1206]  22.95 45.03 90 top
R18  10kΩ  [R1206]  29.15 35.32 270 top
R19  1kΩ  [R1206]  35.65 47.82 0 top
R22  150Ω  [R1206]  16.91 46.5 90 top
R23  10kΩ  [R1206]  26.56 35.32 270 top
R24  2kΩ  [R1206]  35.6 50.41 180 top
R25  10kΩ  [R1206]  34.79 35.22 270 top
R27  10kΩ  [R1206]  56.24 26.65 270 top
R28  10kΩ  [R1206]  41.32 33.83 180 top
R29  10kΩ  [R1206]  58.24 34.81 270 top
R30  10kΩ  [R1206]  41.31 36.31 180 top
R33  1MΩ  [R1206]  58.24 39.76 270 top
R37  10kΩ  [R1206]  23.97 35.32 270 top
R38  150Ω  [R1206]  19.5 46.55 90 top
R39  10kΩ  [R1206]  17.16 35.27 270 top
R40  3kΩ  [R1206]  19.95 35.32 270 top
R41  1MΩ  [R1206]  56.2 44.08 180 top
R42  1MΩ  [R1206]  59.03 26.65 270 top
R43  1MΩ  [R1206]  62.17 44.08 180 top
R44  1MΩ  [R1206]  61.72 26.65 90 top
R45  1MΩ  [R1206]  60.65 39.76 90 top
R50  56.2kΩ  [R0402]  8.47 12.26 270 top
R51  10kΩ  [R0402]  8.02 14.09 0 top
RD_LEVEL2  XH-3A  [CONN-TH_XH-3A]  80.52 65.44 180 top
RD_PRESS1  XH-3A  [CONN-TH_XH-3A]  106.2 65.61 180 top
RP_LEVEL2  XH-3A  [CONN-TH_XH-3A]  69.34 65.44 180 top
RP_PRESS1  XH-3A  [CONN-TH_XH-3A]  95.12 65.56 180 top
TANK1  XH-3A  [CONN-TH_XH-3A]  100.71 49.05 180 top
U4  ADS1115IDGSR  [MSOP-10_L3.0-W3.0-P0.50-LS5.0-BL]  55.19 48.02 270 top
U5  ADS1115IDGSR  [MSOP-10_L3.0-W3.0-P0.50-LS5.0-BL]  62.3 48.02 270 top
U7  FH2.54-09-15PZD  [HDR-TH_15P-P2.54-V-F-1]  27.8 53.61 180 top
U8  FH2.54-09-15PZD  [HDR-TH_15P-P2.54-V-F-1]  27.8 28.21 180 top
U9  MMZ2012Y152BT000  [L0805]  61.92 31.13 0 top
U10  MMZ2012Y152BT000  [L0805]  54.55 37.35 90 top
U11  MMZ2012Y152BT000  [L0805]  61.92 33.8 0 top
U12  MMZ2012Y152BT000  [L0805]  63.19 37.73 90 top
U13  TPS563200DDCR  [SOT-23-6_L2.9-W1.6-P0.95-LS2.8-BR]  11.14 15.56 90 top
VTA1  XH-3A  [CONN-TH_XH-3A]  102.83 28.33 0 top
VTB1  XH-6A  [CONN-TH_6P-P2.50_XH-6A]  99.15 37.73 180 top

## Footprints (pads in the part's own frame, mm; a bottom-side part is the same pattern mirrored in y, then rotated)
C0402
  rect 0.79x0.54 smd: 1(-0.545,0) 2(0.545,0)
C0603
  rect 0.8x0.9 smd: 1(-0.7,0) 2(0.7,0)
C0805
  rect 1.41x1.35 smd: 1(-1,0) 2(1,0)
C1206
  rect 1.485x1.728 smd: 1(-1.593,0) 2(1.593,0)
CONN-TH_6P-P2.50_XH-6A
  rect 1.6x1.6 hole 1: 1(6.213,0)
  round 1.6 hole 1: 2(3.713,0) 3(1.214,0) 4(-1.286,0) 5(-3.787,0) 6(-6.287,0)
CONN-TH_XH-3A
  round 1.8 hole 1: 1(-2.5,0) 2(0,0) 3(2.5,0)
CONN-TH_XH-4A-1
  round 1.75 hole 1.1: 1(-3.75,0) 2(-1.25,0) 3(1.25,0) 4(3.75,0)
FUSE-TH_L24.4-W9.4-P22.60
  round 3 hole 1.8: 1(-11.325,0) 2(11.325,0)
HDR-TH_15P-P2.54-V-F-1
  rect 1.6x1.575 hole 1: 1(-17.78,0)
  round 1.6 hole 1: 2(-15.24,0) 3(-12.7,0) 4(-10.16,0) 5(-7.62,0) 6(-5.08,0) 7(-2.54,0) 8(0,0) 9(2.54,0) 10(5.08,0) 11(7.62,0) 12(10.16,0) 13(12.7,0) 14(15.24,0) 15(17.78,0)
IND-SMD_L4.5-W4.1_SL0420
  rect 1.4x2.3 smd: 1(-1.775,0) 2(1.775,0)
L0805
  rect 1.133x1.377 smd: 1(-0.966,0) 2(0.966,0)
MSOP-10_L3.0-W3.0-P0.50-LS5.0-BL
  oval 0.28x1.62 smd: 1(-1,-2.11) 2(-0.5,-2.11) 3(0,-2.11) 4(0.5,-2.11) 5(1,-2.11) 6(1,2.11) 7(0.5,2.11) 8(0,2.11) 9(-0.5,2.11) 10(-1,2.11)
R0402
  rect 0.566x0.54 smd: 1(-0.433,0) 2(0.433,0)
R1206
  rect 1.208x1.701 smd: 1(-1.479,0) 2(1.479,0)
SOD-123F_L2.8-W1.8-LS3.7-RD
  rect 1x1.2 smd: 1(-1.55,0) 2(1.55,0)
SOT-23-3_L2.9-W1.6-P1.90-LS2.8-BR
  rect 1.07x0.6 smd: 1(1.235,-0.95) 2(1.235,0.95) 3(-1.235,0)
SOT-23-6_L2.9-W1.6-P0.95-LS2.8-BR
  rect 1.1x0.6 smd: 1(1.35,-0.95) 2(1.35,0) 3(1.35,0.95) 4(-1.35,0.95) 5(-1.35,0) 6(-1.35,-0.95)
TO-252-2_L6.6-W5.6-P4.60-LS9.7-BR
  rect 2.54x1 smd: 1(3.426,-2.3) 3(3.426,2.3)
  rect 6.2x5.8 smd: 2(-3.426,0)
TO-252-2_L6.6-W6.1-P4.57-LS9.9-BR-CW
  rect 3x1.6 smd: 1(3.424,-2.29) 3(3.424,2.29)
  rect 6.2x5.8 smd: 2(-3.424,0)

## Nets
As in the schematic, except:
$1N4374: D2.2 Q2.2 VTB1.6
$1N4463: D1.2 Q1.2 VTB1.5
$1N4464: D8.2 Q8.2 VTB1.4
$1N4465: D3.2 Q3.2 VTB1.3
$1N4466: D6.2 Q6.2 VTB1.2
$1N4467: D5.2 Q5.2 VTB1.1

Pads without a net: U7 1 2 3 4 5; U8 3 4 8 10 11 12 13

## Via types
v1: diameter 0.61, hole 0.305, Top Layer to Bottom Layer, 101 vias

## Routing (per net, layer and track width the routed paths; a pad name or vN(x,y) marks a point on that pad's centre or on a via; arc(x,y) is an arc through that point)
3.3V: length 106.8
  Top Layer w0.54: 36.84,21.83 36.63,22.05 Q13.1 ; 36.84,21.83 36.84,21.1 Q12.1 ; 36.84,21.83 37.84,20.83 40.84,20.83 47.84,27.83 47.84,28.83 46.84,29.83 41.84,29.83 39.84,31.83 39.84,33.83
  Top Layer w1: U8.15 11.56,29.74 30.79,29.74 R25.2 34.88,33.83 39.84,33.83 ; v1(44.84,40.31) 42.84,38.31 41.84,38.31 R30.2 39.83,33.84
  Bottom Layer w1: GPS.1 58.57,66.67 OLED1.1 47.84,64.67 47.84,52.67 44.84,49.67 v1(44.84,40.31)
12VACC: length 24.3
  Top Layer w0.9: CN1.3 8.27,63.53 8.27,52.73 10.27,50.73 14.27,50.73 D15.2 14.44,50.44 R22.2
12VS: length 224.8
  Top Layer w0.54: U13.5 11.14,14.96 10.19,15.91 U13.3 v1(9.56,16.91)
  Top Layer w0.9: 93.89,3.51 D1.1 ; 93.89,3.51 D8.1 84.78,3.41 D3.1 75.44,3.36 66.04,3.36 65.99,3.31 D5.1 D7.1 47.14,3.36 37.8,3.36 37.69,3.26 v1(25.39,3.26) ; 93.89,3.51 101.89,3.51 103.89,5.51 ; v1(102.89,7.51) 102.89,6.51 103.89,5.51 ; 8.7,32.1 9.7,31.1 29.7,31.1 33.7,35.1 35.7,35.1 36.7,36.1 36.7,42.94 D9.1 ; 103.89,5.51 105.89,5.51 107.89,3.51 D2.1 ; C16.2 9.44,19.03 v1(7.53,19.03)
  Top Layer w1: v1(7.53,19.03) 7.42,19.03 5.59,17.2 5.59,8.98 1.54,4.94 1.54,3.94 2.25,3.23 3.25,3.23 3.28,3.26 v1(25.39,3.26) ; C16.2 9.68,19.3 C15.2 7.7,23.84 7.7,28.1 8.7,29.1 8.7,33.1 Q15.2
  Bottom Layer w0.54: v1(7.53,19.03) 9.32,19.03 9.56,18.79 v1(9.56,16.91)
  Bottom Layer w0.9: VTA1.1 102.89,25.78 v1(102.89,7.51)
+5V: length 314.7
  Top Layer w0.252: v1(59.84,50.8) 54.86,50.8 U4.1 ; v1(61.84,39.8) 61.84,36.94 R29.2
  Top Layer w0.486: 8.91,11.62 v1(13.2,11.62) 13.91,11.62 14.91,12.62 v1(16.91,12.62) ; 8.51,11.79 R50.2
  Top Layer w0.72: v1(42.24,15.13) 42.24,14.13 41.24,13.13 27.68,13.13 C6.2 C5.2 23.3,13.8 C13.2 ; v1(40.24,19.13) 44.24,19.13 53.24,28.13 v1(56.24,28.13)
  Top Layer w1: v1(56.24,28.13) 56.24,31.33 R29.2 ; C13.2 C14.2 17.73,13.44 v1(16.91,12.62) ; v1(103.8,63.93) 108.57,63.93 v1(111.36,61.14) ; 8.91,11.62 8.68,11.62 ; v1(95.1,44.79) 98.21,47.9 TANK1.3 ; v1(9.55,49.41) v1(6.47,49.41) ; 59.84,34.94 59.84,34.91 60.95,33.8 60.95,31.13
  Bottom Layer w0.252: FP_LEVEL2.3 60.84,50.8 v1(59.84,50.8) 59.84,41.8 v1(61.84,39.8)
  Bottom Layer w0.72: v1(42.24,15.13) 40.24,17.13 v1(40.24,19.13)
  Bottom Layer w1: 16.87,12.68 16.76,12.68 10.54,18.91 10.54,19.19 9.22,20.5 8.38,20.5 ; FD_PRESS1.3 v1(103.8,63.93) 103.8,65.52 RD_PRESS1.3 ; v1(9.55,49.41) 10.02,49.88 U7.15 ; RD_LEVEL2.3 78.15,65.31 78.15,64.8 ; v1(6.47,49.41) 6.38,49.32 6.38,22.35 8.08,20.66 ; 68.48,63.8 73.15,63.8 74.15,64.8 78.15,64.8 ; 68.48,63.8 RP_LEVEL2.3 ; 68.48,63.8 66.84,62.17 FP_LEVEL2.3 ; 78.15,63.8 90.86,63.8 RP_PRESS1.3 92.62,56.93 FP_PRESS1.3 ; 78.15,63.8 FD_LEVEL2.3 ; 78.15,63.8 78.15,64.8 ; v1(95.1,44.79) 93.45,43.14 ; 93.45,43.14 111.13,43.14 112.02,44.03 112.02,54.45 112.06,54.49 112.06,60.44 v1(111.36,61.14) ; 93.45,43.14 89.24,38.93 84.26,38.93 73.46,28.13 v1(56.24,28.13)
GND: length 436.6
  Top Layer w0.252: U12.1 64.01,37.58 v1(64.19,37.58) ; v1(61.75,49.02) U5.1
  Top Layer w0.486: R51.1 7.58,17.09 8.41,17.91 11.73,17.91 12.09,17.56 U13.1
  Top Layer w0.54: C16.1 12.87,17.7 U13.1
  Top Layer w0.72: C13.1 24.89,15.44 C5.1 C6.1 40.02,15.2 40.08,15.26 Q4.3
  Top Layer w0.9: v1(93.33,10.12) 93.57,10.12 R8.2 ; v1(38.44,47.47) 38.44,46.47 37.44,45.47 34.44,45.47 31.44,42.47 31.44,40.47 ; Q14.3 10.86,44.66 10.86,42.54 11.86,41.54 17.86,41.54 19.86,39.54 ; v1(104.33,7.27) 104.33,8.88 R1.2 107.77,13.1 Q2.3 ; 31.44,40.47 Q11.3 ; 31.44,40.47 31.44,36.13 R18.2 ; 19.86,39.54 D10.2 ; 19.86,39.54 21.56,37.84 v1(21.56,35.84) 23.56,33.84 R37.2 ; U10.1 53.55,36.39 49.55,40.39 Q9.3 43.76,43.06 v1(43.44,43.06) ; 40.08,15.26 42.08,17.26 47.11,17.26 R4.2 47.51,17.38 Q7.3 51.87,17.5 R7.2 56.65,17.5 Q5.3 61.31,17.44 R5.2 66.19,17.44 Q6.3 70.78,17.44 R6.2 75.54,17.44 77.87,15.11 77.87,16.11 80.19,18.44 83.89,18.44 R3.2 85.02,17.44 Q8.3 v1(89.33,13.12) ; v1(113.76,8.27) R2.2 ; v1(96.33,13.12) 96.33,14.6 Q1.3 ; v1(38.08,50.41) R24.1
  Top Layer w1: v1(12.93,26.21) 12.93,21.93 C15.1 12.86,19.3 C16.1 16.93,19.28 C14.1 C13.1 ; v1(100.75,52.8) 97.75,55.8 FP_PRESS1.1 97.62,56.93 RP_PRESS1.1 95.88,67.31 85.15,67.31 83.15,65.31 ; v1(55.39,35.39) 55.39,35.55 U10.1 ; v1(41.96,57.74) 34.85,57.74 34.79,57.68 33.73,57.68 33.06,57 33.06,55.95 v1(32.66,55.56) ; R18.2 R23.2 R37.2 ; 83.15,65.31 FD_LEVEL2.1 ; 83.15,65.31 RD_LEVEL2.1 81.02,67.44 73.84,67.44 RP_LEVEL2.1 69.84,63.44 59.41,63.44 GPS.2 49.89,64.22 OLED1.2 43.97,64.17 FH1.2
  Bottom Layer w0.252: v1(64.19,37.58) 62.75,39.02 62.75,40.02 60.75,42.02 60.75,48.02 v1(61.75,49.02) 61.97,48.8 63.84,48.8 FP_LEVEL2.1
  Bottom Layer w0.9: 38.44,48.06 v1(38.44,47.47) ; 38.44,48.06 38.44,50.06 v1(38.08,50.41) ; 38.44,48.06 v1(43.44,43.06) ; v1(89.33,13.12) 92.33,10.12 v1(93.33,10.12) v1(96.33,13.12) 96.33,12.27 102.33,6.27 103.33,6.27 v1(104.33,7.27) 112.76,7.27 v1(113.76,8.27)
  Bottom Layer w1: 108.75,56.8 108.75,65.57 RD_PRESS1.1 ; 108.75,56.8 FD_PRESS1.1 ; 108.75,56.8 102.75,50.8 ; FD_LEVEL2.1 81.15,54.8 73.84,54.8 FP_LEVEL2.1 ; TANK1.1 102.75,49.52 102.75,50.8 ; v1(21.56,35.84) 20.56,35.84 12.93,28.21 ; v1(55.39,35.39) 59.12,35.39 62.75,39.02 ; 12.93,28.21 v1(12.93,26.21) ; 12.93,28.21 U8.14 ; 102.75,50.8 v1(100.75,52.8) ; v1(41.96,57.74) 43.79,59.57 FH1.2 ; U7.14 14.51,55.56 v1(32.66,55.56)
VCC: length 38.4
  Top Layer w0.9: Q15.3 14.77,38.62 v1(14.77,39.99) 15.77,39.99 D10.1 16.22,37.69 R39.1
  Bottom Layer w0.9: v1(14.77,39.99) 14.77,40.53 7.77,47.53 7.77,60.53 CN1.2
ESPD12: length 5.8
  Top Layer w0.9: D16.2 21.64,51.08 20.64,51.08 18.12,53.61 U7.12
$1N4350: length 5
  Top Layer w0.9: Q8.1 93.78,15.12 R16.1
  Top Layer w1: R16.1 R8.1
$1N4351: length 4.9
  Top Layer w0.9: Q7.1 55.91,15.26 R7.1
  Top Layer w1: R7.1 R15.1
$1N4352: length 4.9
  Top Layer w0.9: Q6.1 74.83,15.14 R6.1
  Top Layer w1: R6.1 R14.1
$1N4353: length 5
  Top Layer w0.9: Q5.1 65.44,15.14 R5.1
  Top Layer w1: R5.1 R13.1
$1N4354: length 4.9
  Top Layer w0.9: Q4.1 46.39,15.26 47.23,14.42
  Top Layer w1: 47.23,14.42 R12.1
$1N4355: length 4.9
  Top Layer w0.9: R3.1 84.26,15.11 82.47,15.11
  Top Layer w1: R3.1 R11.1
$1N4356: length 4.8
  Top Layer w0.9: R10.1 113.95,15.11 Q2.1
  Top Layer w1: R10.1 R2.1
$1N4357: length 5
  Top Layer w0.9: Q1.1 103.3,15.12 R9.1
  Top Layer w1: R9.1 R1.1
$1N4371: length 81
  Top Layer w0.9: Q4.2 39.74,8.41 37.8,6.46
  Top Layer w1: 37.8,6.46 44.79,6.46 v1(45.79,5.46) ; v1(98.79,24.29) 102.83,28.33
  Bottom Layer w1: v1(45.79,5.46) 80.79,5.46 87.79,12.46 87.79,13.29 v1(98.79,24.29)
$1N4374: length 37
  Top Layer w0.9: Q2.2 111.71,6.61 D2.2
  Top Layer w1: VTB1.6 110.07,33.09 Q2.2
$1N4376: length 25.9
  Top Layer w0.9: v1(30.26,37.8) 30.15,37.8 R18.1 ; v1(37.84,38.38) 39.84,40.38 Q9.1
  Top Layer w1: v1(30.26,37.8) 28.26,39.8 28.26,41.8 27.26,42.8 23.7,42.8 R17.1
  Bottom Layer w0.9: v1(30.26,37.8) 31.26,36.8 36.26,36.8 v1(37.84,38.38)
$1N4377: length 136.3
  Top Layer w1: R10.2 111.41,20.61 111.41,56.61 109.41,58.61 107.41,58.61 96.41,69.61 43.8,69.61 U7.8
$1N4378: length 80.6
  Top Layer w1: v1(84.26,10.9) 84.26,9.9 R11.2 ; v1(59.26,18.61) 60.26,19.61 76.26,19.61 77.26,18.61 v1(77.26,17.61)
  Bottom Layer w1: v1(77.26,17.61) 77.55,17.61 v1(84.26,10.9) ; U7.9 59.26,19.61 v1(59.26,18.61)
$1N4379: length 69.2
  Top Layer w0.9: v1(34.21,56.53) 35.21,55.53 v1(51.04,55.53) ; v1(51.04,52.53) 45.04,46.53 ; 45.04,46.53 44.84,46.53 Q9.2 ; 45.04,46.53 42.62,44.11 D9.2
  Bottom Layer w0.9: CN1.4 9.77,67.53 23.21,67.53 v1(34.21,56.53) ; v1(51.04,55.53) v1(51.04,52.53)
$1N4380: length 49.6
  Top Layer w1: v1(65.26,10.21) 65.26,10.1 R13.2
  Bottom Layer w1: U8.9 44.26,9.21 64.26,9.21 v1(65.26,10.21)
$1N4381: length 59.6
  Top Layer w1: U8.7 33.34,25.21 33.34,18.21 v1(34.34,17.21) ; v1(74.4,10.27) R14.2
  Bottom Layer w1: v1(74.4,10.27) 71.4,7.27 44.28,7.27 v1(34.34,17.21)
$1N4382: length 74.7
  Top Layer w1: v1(68.71,59.82) 66.71,59.82 60.71,53.82 48.71,53.82 46.71,51.82 41.13,51.82 R19.2 ; v1(81.71,58.82) v1(76.71,58.82)
  Bottom Layer w1: v1(81.71,58.82) 83.71,58.82 95.48,47.05 98.71,47.05 TANK1.2 ; v1(76.71,58.82) 69.71,58.82 v1(68.71,59.82)
$1N4383: length 6.3
  Top Layer w1: U7.6 32.88,51.65 R24.2 34.12,47.87 34.17,47.82
$1N4386: length 6.5
  Bottom Layer w1: CN1.1 19.6,65.53 FH1.1
$1N4402: length 30.1
  Top Layer w0.252: 63.65,43.91 62.65,44.91 62.65,47.26 63.41,48.02 U5.8
  Top Layer w0.72: U11.2 65.4,36.31 65.4,40.16 C2.1 64.4,42.16 63.65,42.91 R43.1 63.49,44.08 R45.2
  Top Layer w1: 63.4,34.31 64.4,33.31 64.4,30.31 62.22,28.13 R44.2
$1N4403: length 30.2
  Top Layer w0.252: FD_LEVEL2.2 74.86,51.02 61.86,51.02 60.86,50.02 v1(57.86,50.02) ; U4.6 57.4,46.92 v1(58.51,46.92)
  Bottom Layer w0.252: v1(57.86,50.02) 57.86,47.56 v1(58.51,46.92)
$1N4407: length 23.6
  Top Layer w0.252: FP_LEVEL2.2 64.34,51.8 54.23,51.8 51.64,49.21 51.64,48.08 52.21,47.52 U4.4
$1N4413: length 40.8
  Top Layer w0.252: U4.5 51.94,47.02 50.52,48.44 50.52,49.44 53.52,52.44 60.52,52.44 66.52,58.44 73.52,58.44 RD_LEVEL2.2
$1N4416: length 68.7
  Top Layer w0.252: U5.5 59.24,46.07 v1(58.48,46.07)
  Bottom Layer w0.252: RD_PRESS1.2 104.2,67.61 66.79,67.61 61.79,62.61 61.79,58.61 56.79,53.61 56.79,47.77 v1(58.48,46.07)
$1N4419: length 31.9
  Top Layer w0.252: U4.8 56.36,48.02 55.68,47.34 55.68,46.08 R41.1
  Top Layer w0.72: C1.1 56.81,42.08 57.68,42.08
  Top Layer w1: R41.1 57.68,41.8 R33.1 ; v1(62.89,32.13) U9.2 ; v1(56.63,33.91) 56.63,39.91 C1.1 ; R42.1 58.63,28.53 v1(58.63,31.91)
  Bottom Layer w1: v1(56.63,33.91) 57.63,32.91 58.63,32.91 ; v1(62.89,32.13) 62.11,32.91 58.63,32.91 ; 58.63,32.91 v1(58.63,31.91)
$1N4423: length 62.4
  Top Layer w0.252: RP_LEVEL2.2 66.51,68.27 45.3,68.27 41.3,64.27 41.3,63.52 47.55,57.27 57.05,57.27 v1(59.3,55.02) ; U4.7 58.18,47.52 58.27,47.6 58.43,47.6 v1(58.59,47.76)
  Bottom Layer w0.252: v1(59.3,55.02) 58.94,55.02 58.44,54.51 58.44,50.27 58.45,50.26 58.45,49.78 58.44,49.77 58.44,47.91 v1(58.59,47.76)
$1N4424: length 46.8
  Top Layer w0.252: U5.6 65.41,46.02 v1(65.52,46.02) ; FD_PRESS1.2 100.3,50.8 97.3,50.8 93.52,47.02 v1(69.52,47.02)
  Bottom Layer w0.252: v1(69.52,47.02) 66.52,47.02 v1(65.52,46.02)
$1N4428: length 38.4
  Top Layer w0.252: U5.7 65.41,47.52 v1(65.7,47.23) ; v1(69.12,48.56) 78.12,48.56 RP_PRESS1.2
  Bottom Layer w0.252: v1(65.7,47.23) 67.03,48.56 v1(69.12,48.56)
$1N4434: length 24.4
  Top Layer w1: v1(23.56,50.23) 26.56,47.23 Q11.2 30.05,46.23 v1(30.05,41.44) ; v1(33.05,38.44) R25.1
  Bottom Layer w1: v1(30.05,41.44) v1(33.05,38.44) ; v1(23.56,50.23) U7.11
$1N4435: length 10.8
  Top Layer w1: 22.95,46.5 21.85,47.61 v1(21.1,47.61)
  Bottom Layer w1: U7.13 v1(21.1,47.61)
$1N4436: length 53.3
  Top Layer w1: v1(52.58,21.21) 90.64,21.21 R16.2
  Bottom Layer w1: U8.1 v1(52.58,21.21)
$1N4438: length 90.3
  Top Layer w1: v1(57.34,23.61) 97.77,23.61 R9.2
  Bottom Layer w1: v1(57.34,23.61) 30.34,50.61 U7.7
$1N4442: length 32.4
  Top Layer w1: v1(56.63,10.83) 56.63,9.34
  Bottom Layer w1: U8.6 50.27,10.83 v1(56.63,10.83)
$1N4443: length 40.8
  Top Layer w0.252: U5.4 61.19,47.52 v1(61.53,47.18) ; FP_PRESS1.2 86.25,47.8 v1(73.25,47.8)
  Bottom Layer w0.252: v1(73.25,47.8) 70.63,45.18 63.53,45.18 v1(61.53,47.18)
$1N4453: length 66.9
  Top Layer w0.252: R42.2 59.38,25.52 61.41,25.52 68.41,32.52 68.41,47.52 67.41,48.52 U5.9 64.37,48.56 63.6,48.56 62.57,49.6 61.51,49.6 61.47,49.56 58.76,49.56 58.39,49.19 58.39,48.85 58.06,48.52 U4.9
  Top Layer w0.54: Q12.3 45.3,18.24 52.24,25.17 R27.2
  Top Layer w1: R42.2 R27.2 ; 61.41,25.52 R44.1
$1N4455: length 16
  Top Layer w0.9: v1(16.91,44.02) R22.1 ; R23.1 26.75,36.99 Q11.1 22.75,40.38 v1(19.75,43.38)
  Bottom Layer w0.9: v1(19.75,43.38) 17.55,43.38 v1(16.91,44.02)
$1N4460: length 85.7
  Top Layer w1: v1(31.96,23.61) 28.96,20.61 v1(14.96,20.61) ; 47.23,9.34 46.96,9.61 v1(46.96,10.61)
  Bottom Layer w1: v1(31.96,23.61) 44.96,10.61 v1(46.96,10.61) ; U7.10 25.72,50.61 25.72,44.38 11.96,30.61 9.96,30.61 7.96,28.61 7.96,27.61 v1(14.96,20.61)
$1N4463: length 38.1
  Top Layer w0.9: Q1.2 95.99,8.27 D1.2
  Top Layer w1: Q1.2 99.16,18.27 v1(100.16,19.27)
  Bottom Layer w1: VTB1.5 98.16,32.95 98.16,27.27 100.16,25.27 v1(100.16,19.27)
$1N4464: length 39.4
  Top Layer w0.9: Q8.2 86.54,8.27 D8.2
  Top Layer w1: Q8.2 90.63,9.27 v1(90.63,18.27)
  Bottom Layer w1: VTB1.4 90.63,27.92 v1(90.63,18.27)
$1N4465: length 42.2
  Top Layer w0.9: D3.2 77.24,8.26 Q3.2
  Top Layer w1: v1(81.17,17.26) 80.17,16.26 Q3.2
  Bottom Layer w1: VTB1.3 81.17,20.96 v1(81.17,17.26)
$1N4466: length 45.4
  Top Layer w0.9: 66.04,6.46 67.87,8.29 Q6.2
  Top Layer w1: Q6.2 70.78,13.07 v1(71.78,14.07)
  Bottom Layer w1: v1(71.78,14.07) 93.78,36.07 94.28,36.07 95.44,37.23 VTB1.2
$1N4467: length 52.6
  Top Layer w0.9: D5.2 58.67,8.29 Q5.2
  Top Layer w1: v1(62.31,15.29) 61.31,14.29 Q5.2
  Bottom Layer w1: v1(62.31,15.29) 84.75,37.73 VTB1.1
$1N4475: length 17.5
  Top Layer w1: v1(17.67,39.03) 17.73,39.03 R40.1 ; Q14.2 v1(12.67,39.03)
  Bottom Layer w1: v1(12.67,39.03) 13.67,38.03 16.67,38.03 v1(17.67,39.03)
$1N4476: length 6.8
  Top Layer w1: R40.2 19.9,33.79 R39.2 16.18,32.81 Q15.1
$1N4478: length 16.3
  Top Layer w0.9: 17.65,42.73 18.15,43.23 18.15,43.73 R38.1 ; Q14.1 16.53,42.73
  Top Layer w1: 16.53,42.73 18.53,42.73 23.97,37.28 R37.1
$1N4481: length 71.2
  Top Layer w0.9: Q7.2 49.19,8.41 D7.2
  Top Layer w1: VTA1.3 103.33,30.33 85.85,30.33 v1(83.85,28.33) ; v1(52.93,13.41) 51.93,12.41 Q7.2
  Bottom Layer w1: v1(52.93,13.41) 68.93,13.41 v1(83.85,28.33)
$1N12707: length 11.7
  Top Layer w0.252: U4.3 54.08,48.02 54.23,47.86 54.23,45.86 53.23,44.86 53.23,41.91 C1.2
  Top Layer w0.72: C1.2 54.23,38.64 54.55,38.32
$1N12784: length 5.9
  Top Layer w0.252: R41.2 54.73,48.13 54.33,48.52 U4.2
$1N13030: length 15.5
  Top Layer w0.252: v1(65,42.89) 65,44.89 v1(64,45.89) ; v1(62,47.89) 61.87,48.02 U5.3 ; 63,38.89 v1(64,39.89)
  Top Layer w0.72: U12.2 63,38.89 C2.2
  Bottom Layer w0.252: v1(65,42.89) 64,41.89 v1(64,39.89) ; v1(64,45.89) v1(62,47.89)
$1N13089: length 7.2
  Top Layer w0.252: v1(59.12,44.08) R43.2 ; U5.2 60.15,48.56 59.38,48.56 59.27,48.45 v1(59.09,48.45)
  Bottom Layer w0.252: v1(59.12,44.08) 59.03,44.18 59.03,45.79 59.18,45.94 59.18,48.26 59.09,48.35 v1(59.09,48.45)
$1N19364: length 54.4
  Top Layer w0.54: v1(36.42,26.21) 34.55,24.34 Q12.2
  Top Layer w1: v1(44.84,38.35) R30.1 v1(41.79,35.31)
  Bottom Layer w0.54: v1(36.42,26.21) 35.42,27.21 U8.5
  Bottom Layer w1: GPS.4 58.57,59.17 OLED1.4 49.84,52.17 46.84,49.17 46.84,40.35 v1(44.84,38.35) ; U8.5 41.79,34.58 v1(41.79,35.31)
$1N19403: length 99.2
  Top Layer w0.252: v1(58.24,37.29) 58.24,38.29 ; U4.10 v1(55.3,49.02) ; v1(69.3,50.02) 65.41,50.02 U5.10
  Top Layer w0.54: Q13.3 35.43,22.52 35.43,20.02 35.93,19.52 36.93,19.52 37.43,20.02 41.3,20.02 54.3,33.02 v1(54.3,35.02)
  Top Layer w1: v1(58.24,37.29) R29.1 ; 58.24,38.29 60.65,38.29
  Bottom Layer w0.252: 55.3,37.02 57.97,37.02 v1(58.24,37.29) ; 55.3,37.02 v1(55.3,49.02) ; 55.3,37.02 54.3,36.02 v1(54.3,35.02) 58.3,31.02 63.3,31.02 74.3,42.02 74.3,48.02 72.3,50.02 v1(69.3,50.02)
$1N19476: length 58.7
  Top Layer w0.54: v1(42.04,27.21) 42.04,25.71 Q13.2
  Top Layer w1: v1(42.8,30.83) R28.1 47.57,38.61 v1(47.57,38.67)
  Bottom Layer w0.54: U8.2 v1(42.04,27.21)
  Bottom Layer w1: v1(42.8,30.83) 42.8,28.46 U8.2 ; 58.57,61.67 GPS.3 ; 58.57,61.67 60.57,59.67 60.57,58.67 48.57,46.67 48.57,39.67 v1(47.57,38.67) ; 58.57,61.67 OLED1.3
$1N23795: length 4.2
  Top Layer w0.9: D15.1 19.07,50.56 19.07,48.46 19.5,48.03
$1N33541: length 1.6
  Top Layer w0.486: C12.1 12.12,14.18 U13.6
$1N33542: length 10.2
  Top Layer w0.486: 14.21,14.64 12.94,15.91 11.41,15.91 11.14,16.18 U13.2 ; 14.21,14.64 15.38,14.64 16.91,16.17 ; 14.21,14.64 13.21,13.64 C12.2
$1N33547: length 3.2
  Top Layer w0.486: 8.47,12.69 8.47,14.06 R51.2 10.07,14.09 U13.4

## Copper pours and planes (outline as drawn; the poured copper is in the pictures)
12VS on Top Layer: 0.61,40.27 5.94,40.27 5.94,-0.93 0.61,-0.93
12VS on Top Layer: 5.64,30.46 7.43,28.67 7.43,19.14 7.53,19.03 5.71,17.2 5.59,17.2 5.59,30.41
12VS on Top Layer: 5.18,4.4 113.18,4.4 113.18,-0.88 5.18,-0.88
+5V on Top Layer: 20.77,12.62 18.94,12.62 17.98,11.67 14.12,11.67 13.61,11.16 8.03,11.16 8.03,12.26 14.01,12.26 14.78,13.04 15.3,13.04 15.86,13.59 17.01,13.59 17.53,14.1 20.77,14.1
+5V on Top Layer: 20.12,14.15 27.43,14.15 27.43,10.75 20.12,10.75
GND on Top Layer: -5.13,73.44 122.99,73.44 122.99,-5.91 -5.13,-5.91
GND on Bottom Layer: -2.23,72.73 120.29,72.73 120.29,-3.98 -2.23,-3.98

## Text on the board
Bottom Silkscreen Layer: Bw - Improvements / PsychePone - information / slewedsilver - information | PCB Design Contibutors to OAS-Man: | Paspartuu - esp32 board design / AJBugMan - nano board design / gopro_2027 - nano & esp32 board design / WhiskyTngo - SMD Board Conversion | OAS-Man (Open Source Air Suspension Management) / GNU GPL v3.0 | PCB Design Contibutors to OAS-Man: / Paspartuu - esp32 board design / AJBugMan - nano board design / gopro_2027 - nano & esp32 board design / WhiskyTngo - SMD Board Conversion / Bw - Improvements / PsychePone - information / slewedsilver - information
Top Silkscreen Layer: Left Hand Drive Designation / F = Front, R = Rear / D = Driver (Left) / P = Passenger (Right) / I = In (Air Up), O = Out (Air Down) | RP | FP | RD | FD | 5X20 FUSE 3A | TANK | GND | 5V | SIG | Valve Control Output / Constant 12V-Negative Trigger | Level Sense | Pressure Sense | 12V / ACC | 12V / BATT | I/O  12V | 15 | 30 | 16 | 1 | RDO | RDI | FDI | RPI | SW / 12V | FDO | FPI | RPO | FPO | 3v3 | SCL | SDA | DISPLAY / 3.3v I2C | COMP | USB
